# EAGLE schematic Supercell 1.3 (EAGLE 8.2.2)

## Sheet 1 of 5: Power
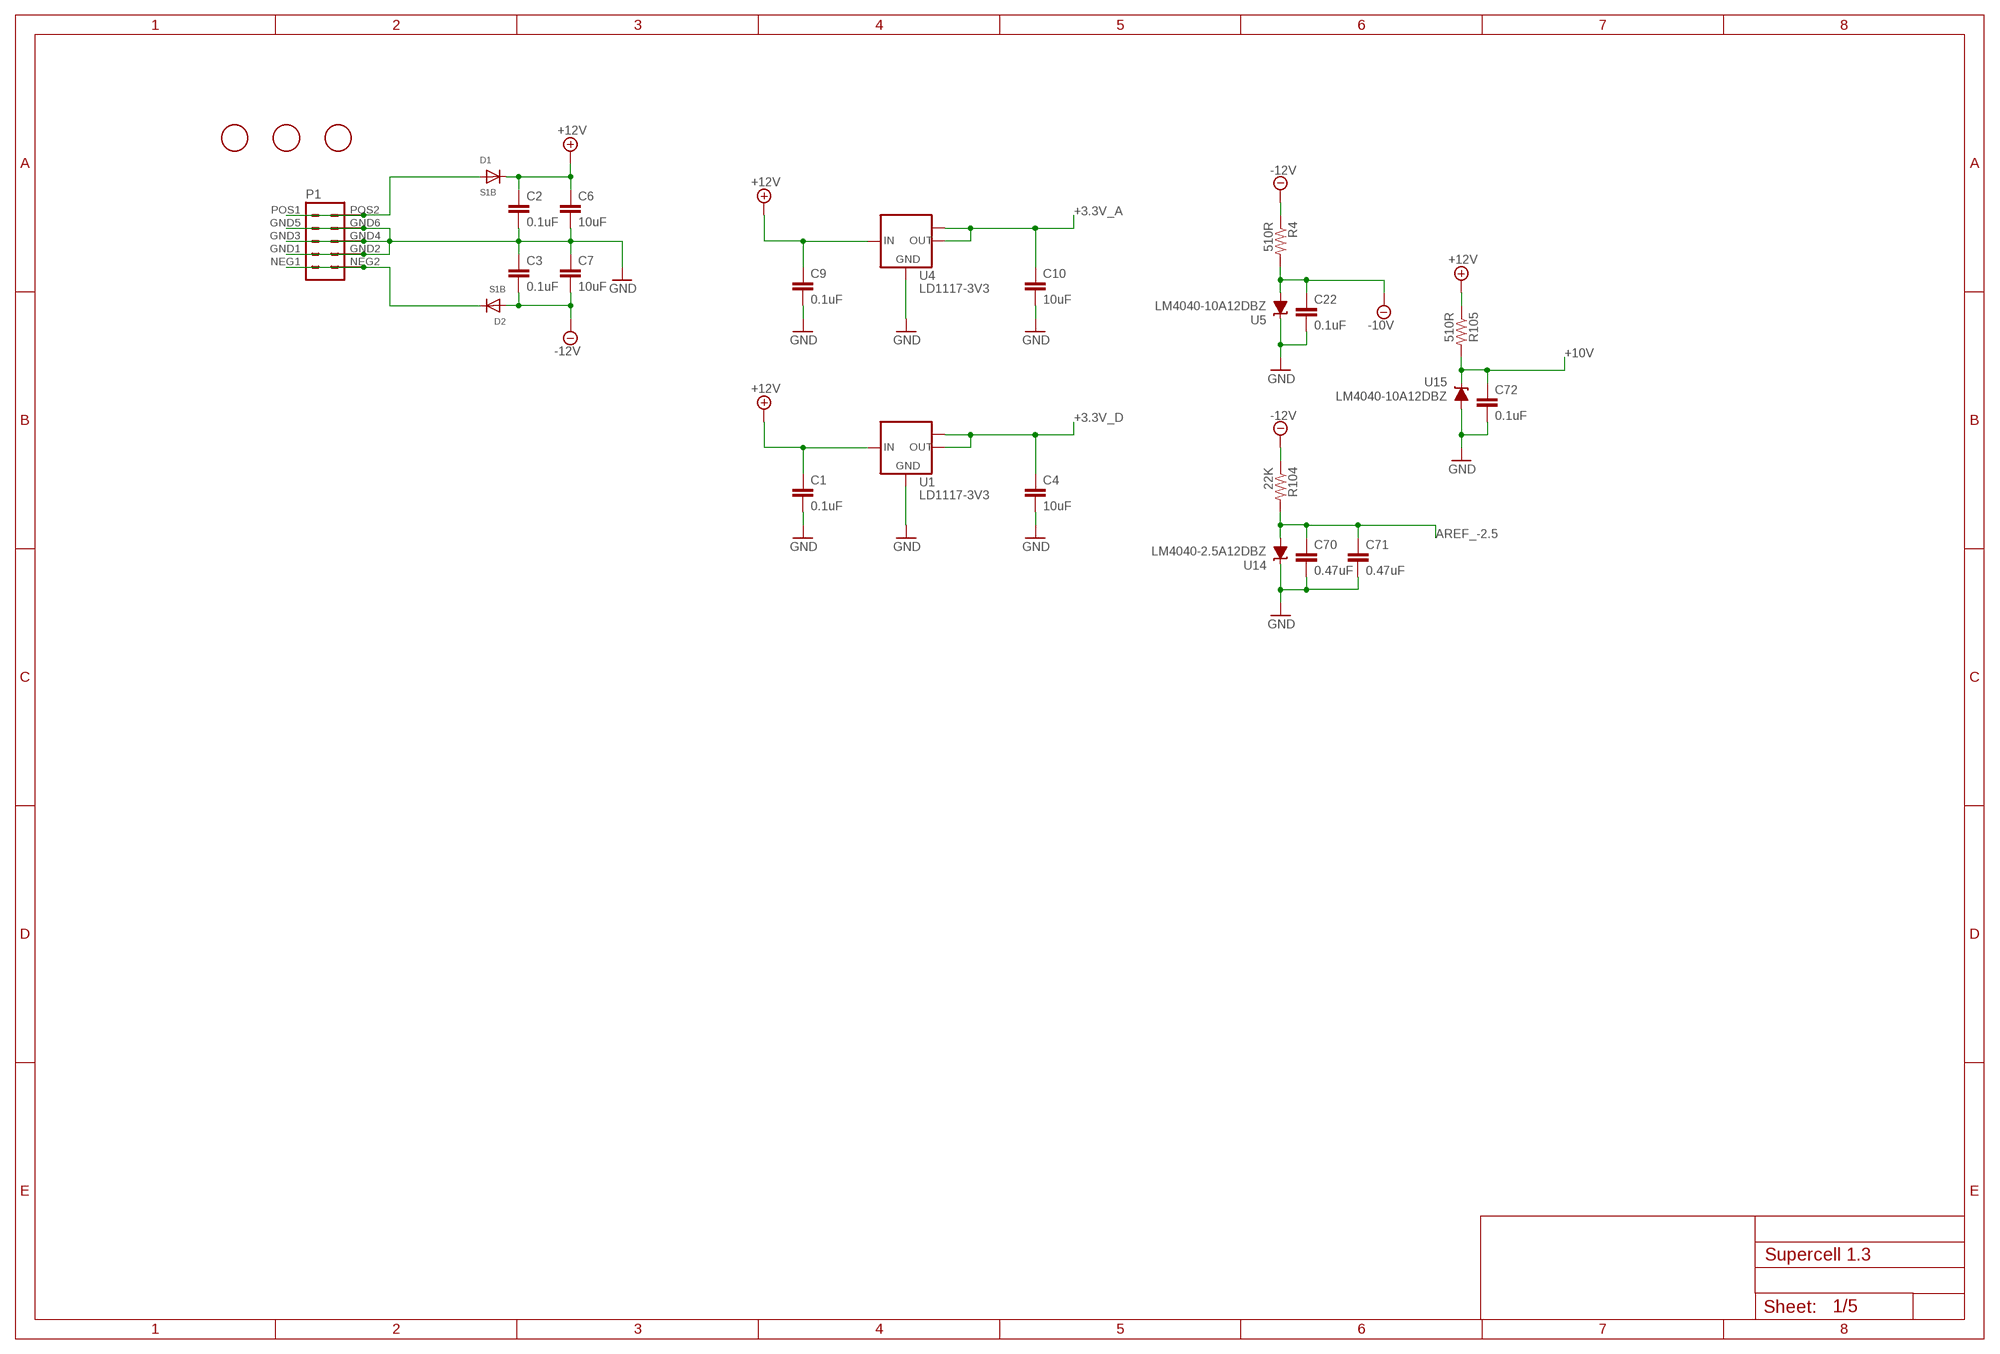
[diagram p0: schematic, sheet 1]

### Parts
C1  0.1uF  C-EUC0603  [C0603]
C2  0.1uF  C-EUC0603  [C0603]
C3  0.1uF  C-EUC0603  [C0603]
C4  10uF  C-EUC0805  [C0805]
C6  10uF  C-EUC0805  [C0805]
C7  10uF  C-EUC0805  [C0805]
C9  0.1uF  C-EUC0603  [C0603]
C10  10uF  C-EUC0805  [C0805]
C22  0.1uF  C-EUC0603  [C0603]
C70  0.47uF  C-EUC0603  [C0603]
C71  0.47uF  C-EUC0603  [C0603]
C72  0.1uF  C-EUC0603  [C0603]
D1  S1B  DIODESMA  [SMADIODE]
D2  S1B  DIODESMA  [SMADIODE]
FD1  FIDUCIAL  [FIDUCIAL_1MM]
FD2  FIDUCIAL  [FIDUCIAL_1MM]
FD3  FIDUCIAL  [FIDUCIAL_1MM]
P1  EURO_POWER_HEADERLOCK_PADS  [EURO_PWR_HEADER_LOCK]
R4  510R  R-US_R0603  [R0603]
R104  22K  R-US_R0603  [R0603]
R105  510R  R-US_R0603  [R0603]
U1  LD1117-3V3  LM1117MPX-3.3  [SOT223]
U4  LD1117-3V3  LM1117MPX-3.3  [SOT223]
U5  LM4040-10A12DBZ  [DBZ_R-PDSO-G3]
U14  LM4040-2.5A12DBZ  [DBZ_R-PDSO-G3]
U15  LM4040-10A12DBZ  [DBZ_R-PDSO-G3]

### Nets
+3.3V_A: C10.1 U4.2(OUT) U4.TAB(OUT1) ; also sheet 2,3,4
+3.3V_D: C4.1 U1.2(OUT) U1.TAB(OUT1) ; also sheet 2,3,4
+10V: C72.1 R105.2 U15.1(C) ; also sheet 5
+12V: C1.1 C2.1 C6.1 C9.1 D1.C R105.1 U1.3(IN) U4.3(IN) ; also sheet 3,5
-10V: C22.1 R4.2 U5.2(A) ; also sheet 3
-12V: C3.2 C7.2 D2.A R4.1 R104.1 ; also sheet 3,5
AREF_-2.5: C70.1 C71.1 R104.2 U14.2(A) ; also sheet 5
GND: C1.2 C2.2 C3.1 C4.2 C6.2 C7.1 C9.2 C10.2 C22.2 C70.2 C71.2 C72.2 P1.GND1 P1.GND2 P1.GND3 P1.GND4 P1.GND5 P1.GND6 U1.1(GND) U4.1(GND) U5.1(C) U14.1(C) U15.2(A) ; also sheet 2,3,4,5
N$2: D1.A P1.POS1 P1.POS2
N$6: D2.C P1.NEG1 P1.NEG2

## Sheet 2 of 5: Digital
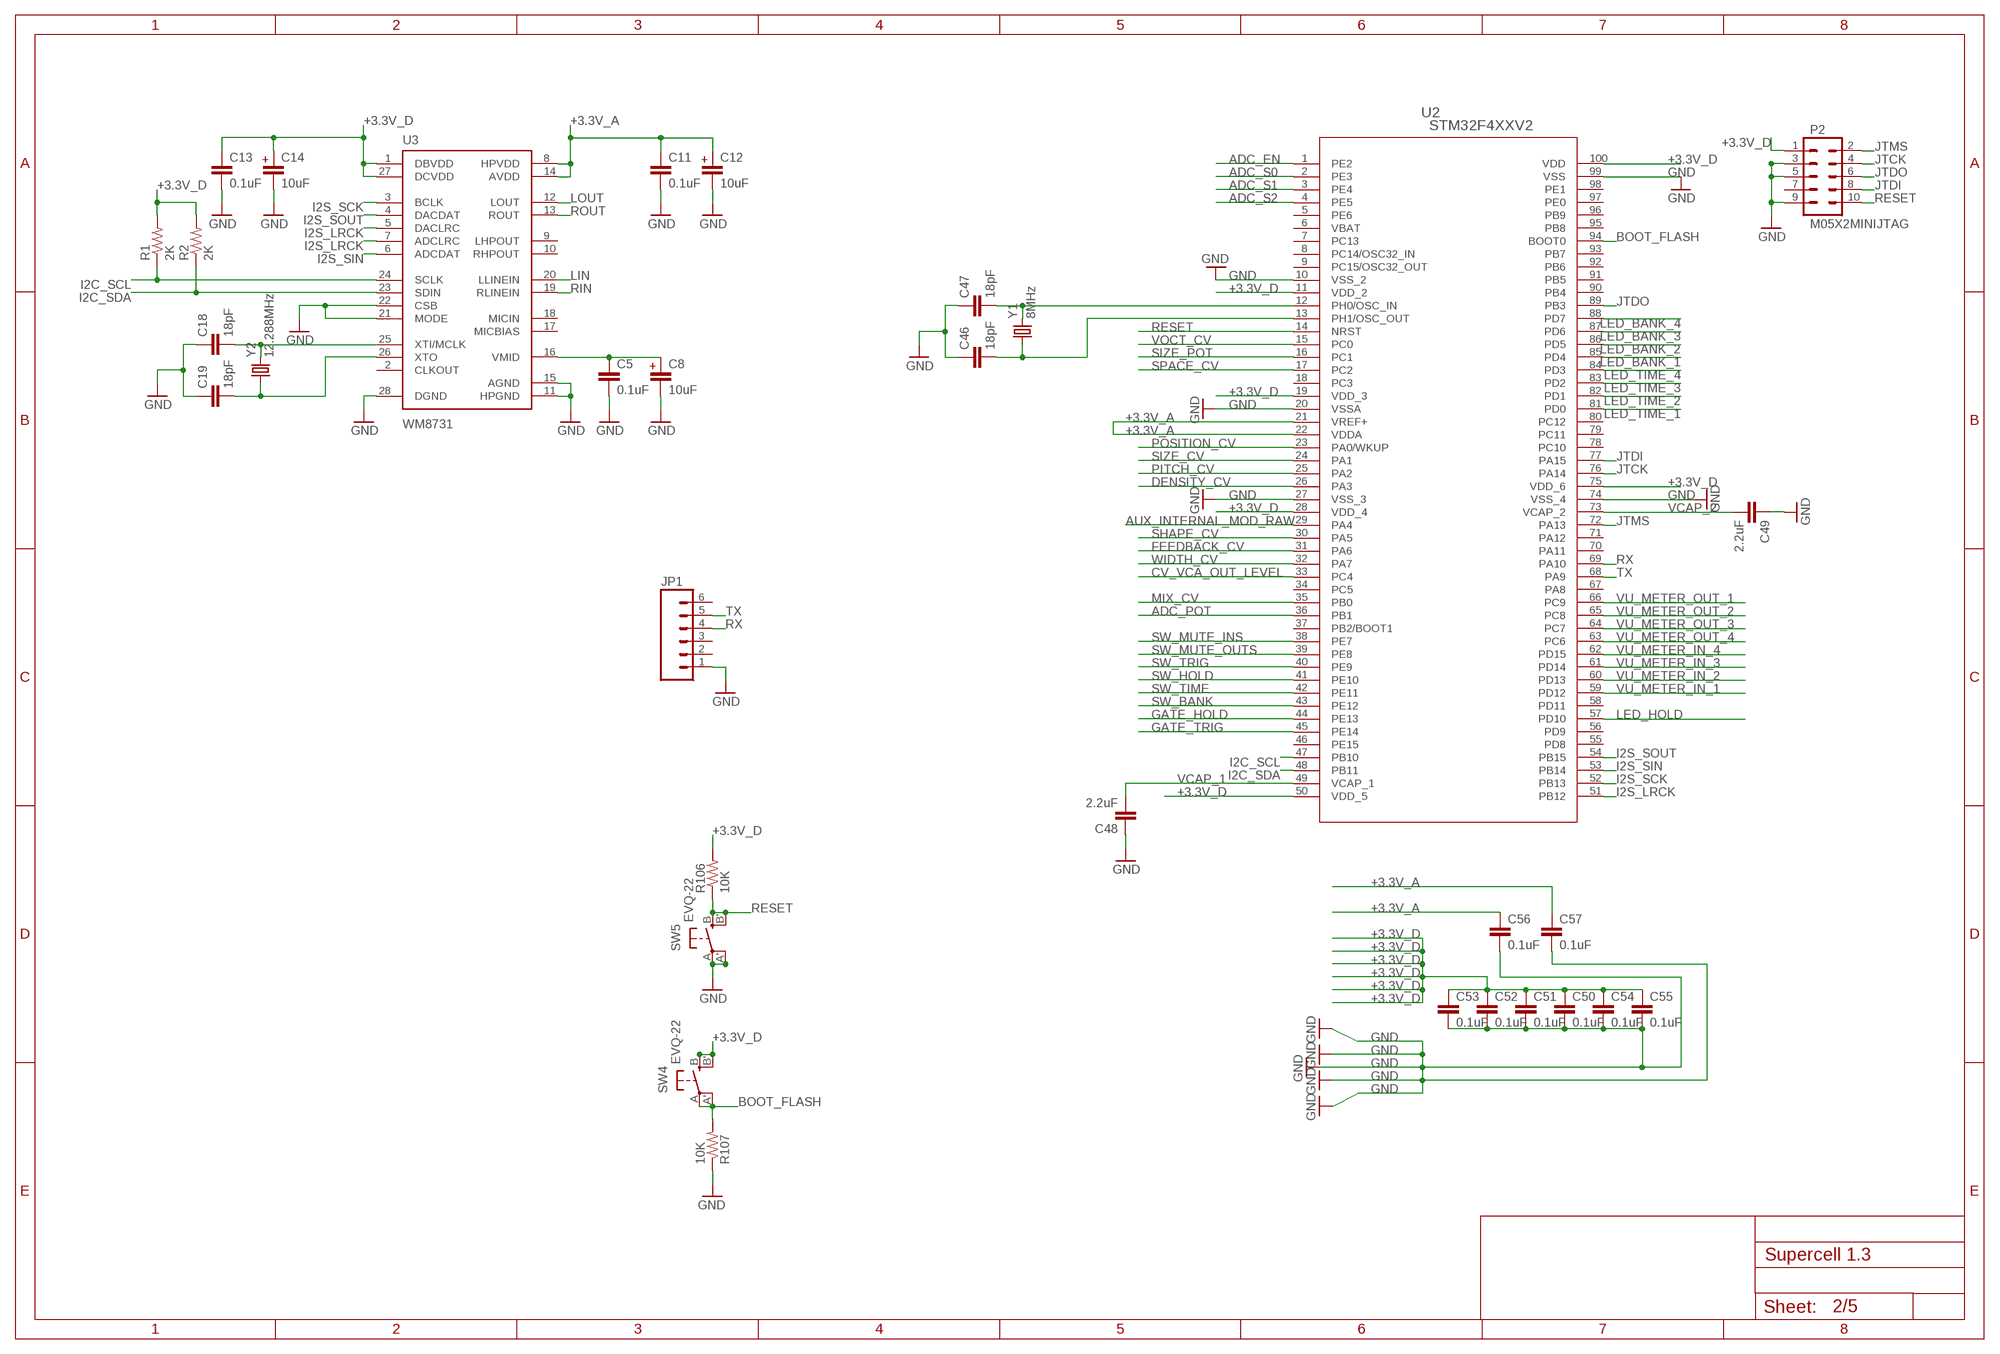
[diagram p1: schematic, sheet 2]

### Parts
C5  0.1uF  C-EUC0603  [C0603]
C8  10uF  C-EU-POL_4D  [EC-4X7]
C11  0.1uF  C-EUC0603  [C0603]
C12  10uF  C-EU-POL_4D  [EC-4X7]
C13  0.1uF  C-EUC0603  [C0603]
C14  10uF  C-EU-POL_4D  [EC-4X7]
C18  18pF  C-EUC0603  [C0603]
C19  18pF  C-EUC0603  [C0603]
C46  18pF  C-EUC0603  [C0603]
C47  18pF  C-EUC0603  [C0603]
C48  2.2uF  C-EUC0603  [C0603]
C49  2.2uF  C-EUC0603  [C0603]
C50  0.1uF  C-EUC0603  [C0603]
C51  0.1uF  C-EUC0603  [C0603]
C52  0.1uF  C-EUC0603  [C0603]
C53  0.1uF  C-EUC0603  [C0603]
C54  0.1uF  C-EUC0603  [C0603]
C55  0.1uF  C-EUC0603  [C0603]
C56  0.1uF  C-EUC0603  [C0603]
C57  0.1uF  C-EUC0603  [C0603]
JP1  M06SIP  [1X06]
P2  M05X2MINIJTAG  [2X5-1.27]
R1  2K  R-US_R0603  [R0603]
R2  2K  R-US_R0603  [R0603]
R106  10K  R-US_R0603  [R0603]
R107  10K  R-US_R0603  [R0603]
SW4  EVQ-22  EVQQ2  [EVQ-Q2]
SW5  EVQ-22  EVQQ2  [EVQ-Q2]
U2  STM32F4XXV2  [LQFP100-14X14MM]
U3  WM8731  [SSOP28]
Y1  8MHz  CRYSTALHC49UP  [HC49UP]
Y2  12.288MHz  CRYSTALHC49UP  [HC49UP]

### Nets
+3.3V_A: C11.1 C12.P$1(POS) C56.1 C57.1 U2.21(VREF+) U2.22(VDDA) U3.8(HPVDD) U3.14(AVDD) ; also sheet 1,3,4
+3.3V_D: C13.1 C14.P$1(POS) C50.1 C51.1 C52.1 C53.1 C54.1 C55.1 P2.1 R1.2 R2.2 R106.2 SW4.B'(S1) SW4.B(S) U2.11(VDD_2) U2.19(VDD_3) U2.28(VDD_4) U2.50(VDD_5) U2.75(VDD_6) U2.100(VDD) U3.1(DBVDD) U3.27(DCVDD) ; also sheet 1,3,4
ADC_EN: U2.1(PE2) ; also sheet 4
ADC_POT: U2.36(PB1) ; also sheet 4
ADC_S0: U2.2(PE3) ; also sheet 4
ADC_S1: U2.3(PE4) ; also sheet 4
ADC_S2: U2.4(PE5) ; also sheet 4
AUX_INTERNAL_MOD_RAW: U2.29(PA4) ; also sheet 3
BOOT_FLASH: R107.2 SW4.A'(P1) SW4.A(P) U2.94(BOOT0)
CV_VCA_OUT_LEVEL: U2.33(PC4) ; also sheet 5
DENSITY_CV: U2.26(PA3) ; also sheet 3
FEEDBACK_CV: U2.31(PA6) ; also sheet 3
GATE_HOLD: U2.44(PE13) ; also sheet 3
GATE_TRIG: U2.45(PE14) ; also sheet 3
GND: C5.2 C8.P$2(NEG) C11.2 C12.P$2(NEG) C13.2 C14.P$2(NEG) C18.1 C19.1 C46.1 C47.1 C48.1 C49.1 C50.2 C51.2 C52.2 C53.2 C54.2 C55.2 C56.2 C57.2 JP1.1 P2.3 P2.5 P2.9 R107.1 SW5.A'(P1) SW5.A(P) U2.10(VSS_2) U2.20(VSSA) U2.27(VSS_3) U2.74(VSS_4) U2.99(VSS) U3.11(HPGND) U3.15(AGND) U3.21(MODE) U3.22(CSB) U3.28(DGND) ; also sheet 1,3,4,5
I2C_SCL: R1.1 U2.47(PB10) U3.24(SCLK)
I2C_SDA: R2.1 U2.48(PB11) U3.23(SDIN)
I2S_LRCK: U2.51(PB12) U3.5(DACLRC) U3.7(ADCLRC)
I2S_SCK: U2.52(PB13) U3.3(BCLK)
I2S_SIN: U2.53(PB14) U3.6(ADCDAT)
I2S_SOUT: U2.54(PB15) U3.4(DACDAT)
JTCK: P2.4 U2.76(PA14)
JTDI: P2.8 U2.77(PA15)
JTDO: P2.6 U2.89(PB3)
JTMS: P2.2 U2.72(PA13)
LED_BANK_1: U2.85(PD4) ; also sheet 4
LED_BANK_2: U2.86(PD5) ; also sheet 4
LED_BANK_3: U2.87(PD6) ; also sheet 4
LED_BANK_4: U2.88(PD7) ; also sheet 4
LED_HOLD: U2.57(PD10) ; also sheet 4
LED_TIME_1: U2.81(PD0) ; also sheet 4
LED_TIME_2: U2.82(PD1) ; also sheet 4
LED_TIME_3: U2.83(PD2) ; also sheet 4
LED_TIME_4: U2.84(PD3) ; also sheet 4
LIN: U3.20(LLINEIN) ; also sheet 5
LOUT: U3.12(LOUT) ; also sheet 5
MIX_CV: U2.35(PB0) ; also sheet 3
N$1: C5.1 C8.P$1(POS) U3.16(VMID)
N$59: C19.2 U3.26(XTO) Y2.1
N$60: C18.2 U3.25(XTI/MCLK) Y2.2
N$112: C46.2 U2.13(PH1/OSC_OUT) Y1.1
N$114: C47.2 U2.12(PH0/OSC_IN) Y1.2
PITCH_CV: U2.25(PA2) ; also sheet 3
POSITION_CV: U2.23(PA0/WKUP) ; also sheet 3
RESET: P2.10 R106.1 SW5.B'(S1) SW5.B(S) U2.14(NRST)
RIN: U3.19(RLINEIN) ; also sheet 5
ROUT: U3.13(ROUT) ; also sheet 5
RX: JP1.4 U2.69(PA10)
SHAPE_CV: U2.30(PA5) ; also sheet 3
SIZE_CV: U2.24(PA1) ; also sheet 3
SIZE_POT: U2.16(PC1) ; also sheet 4
SPACE_CV: U2.17(PC2) ; also sheet 3
SW_BANK: U2.43(PE12) ; also sheet 4
SW_HOLD: U2.41(PE10) ; also sheet 4
SW_MUTE_INS: U2.38(PE7) ; also sheet 4
SW_MUTE_OUTS: U2.39(PE8) ; also sheet 4
SW_TIME: U2.42(PE11) ; also sheet 4
SW_TRIG: U2.40(PE9) ; also sheet 4
TX: JP1.5 U2.68(PA9)
VCAP_1: C48.2 U2.49(VCAP_1)
VCAP_2: C49.2 U2.73(VCAP_2)
VOCT_CV: U2.15(PC0) ; also sheet 3
VU_METER_IN_1: U2.59(PD12) ; also sheet 4
VU_METER_IN_2: U2.60(PD13) ; also sheet 4
VU_METER_IN_3: U2.61(PD14) ; also sheet 4
VU_METER_IN_4: U2.62(PD15) ; also sheet 4
VU_METER_OUT_1: U2.66(PC9) ; also sheet 4
VU_METER_OUT_2: U2.65(PC8) ; also sheet 4
VU_METER_OUT_3: U2.64(PC7) ; also sheet 4
VU_METER_OUT_4: U2.63(PC6) ; also sheet 4
WIDTH_CV: U2.32(PA7) ; also sheet 3
Unconnected: JP1.2 JP1.3 JP1.6 P2.7 U2.5(PE6) U2.7(PC13) U2.8(PC14/OSC32_IN) U2.9(PC15/OSC32_OUT) U2.18(PC3) U2.34(PC5) U2.37(PB2/BOOT1) U2.46(PE15) U2.55(PD8) U2.56(PD9) U2.58(PD11) U2.67(PA8) U2.70(PA11) U2.71(PA12) U2.78(PC10) U2.79(PC11) U2.80(PC12) U2.90(PB4) U2.91(PB5) U2.92(PB6) U2.93(PB7) U2.95(PB8) U2.96(PB9) U2.97(PE0) U2.98(PE1) U3.2(CLKOUT) U3.9(LHPOUT) U3.10(RHPOUT) U3.17(MICBIAS) U3.18(MICIN)

## Sheet 3 of 5: Control Signals
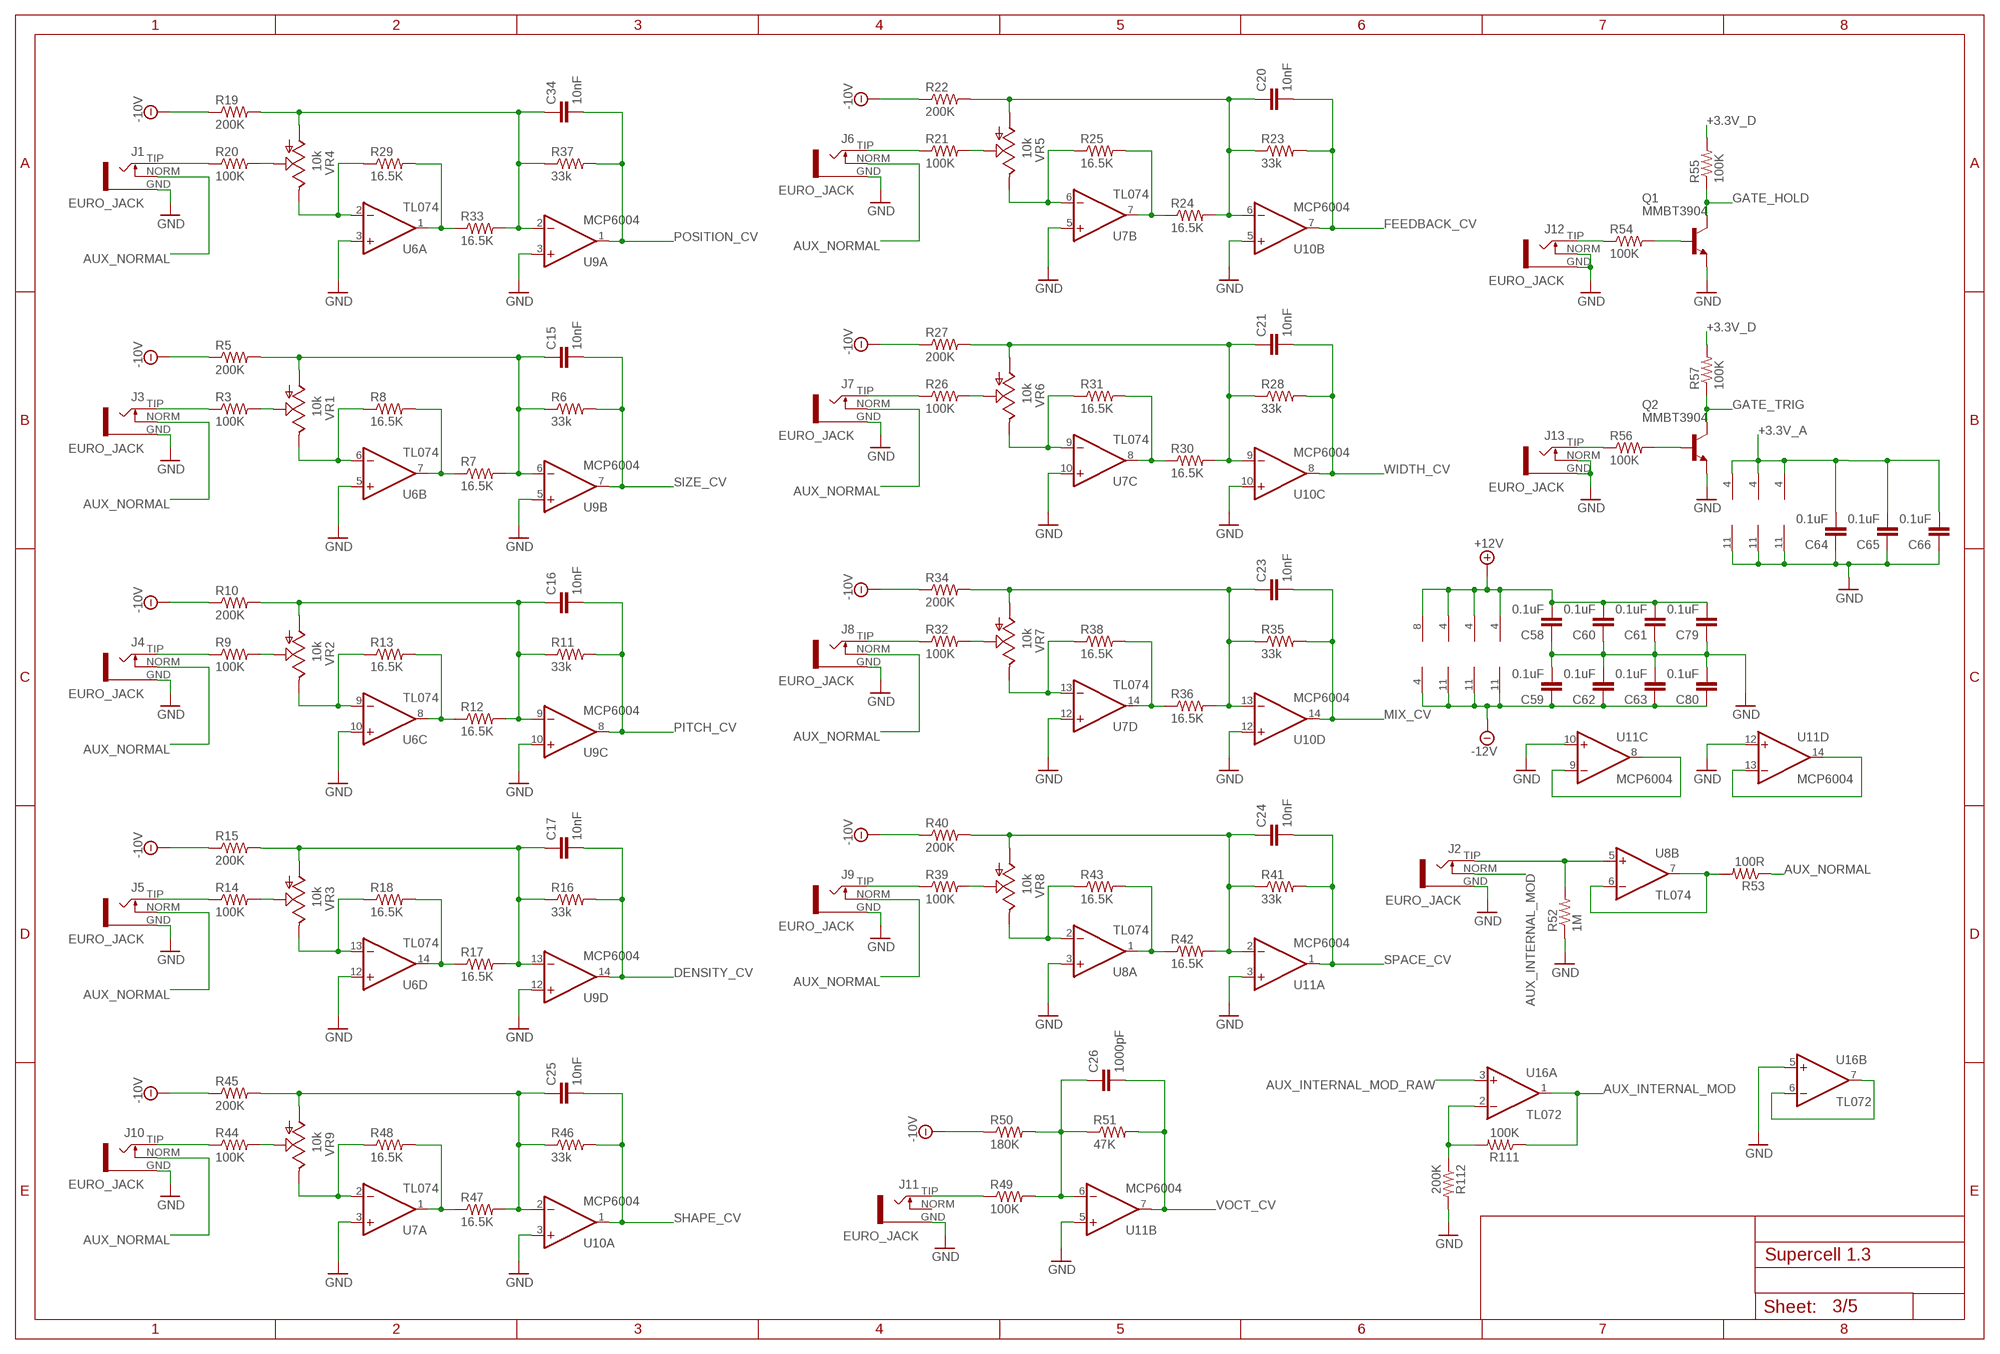
[diagram p2: schematic, sheet 3]

### Parts
C15  10nF  C-EUC0603  [C0603]
C16  10nF  C-EUC0603  [C0603]
C17  10nF  C-EUC0603  [C0603]
C20  10nF  C-EUC0603  [C0603]
C21  10nF  C-EUC0603  [C0603]
C23  10nF  C-EUC0603  [C0603]
C24  10nF  C-EUC0603  [C0603]
C25  10nF  C-EUC0603  [C0603]
C26  1000pF  C-EUC0603  [C0603]
C34  10nF  C-EUC0603  [C0603]
C58  0.1uF  C-EUC0603  [C0603]
C59  0.1uF  C-EUC0603  [C0603]
C60  0.1uF  C-EUC0603  [C0603]
C61  0.1uF  C-EUC0603  [C0603]
C62  0.1uF  C-EUC0603  [C0603]
C63  0.1uF  C-EUC0603  [C0603]
C64  0.1uF  C-EUC0603  [C0603]
C65  0.1uF  C-EUC0603  [C0603]
C66  0.1uF  C-EUC0603  [C0603]
C79  0.1uF  C-EUC0603  [C0603]
C80  0.1uF  C-EUC0603  [C0603]
J1  EURO_JACK  [S_JACK]
J2  EURO_JACK  [S_JACK]
J3  EURO_JACK  [S_JACK]
J4  EURO_JACK  [S_JACK]
J5  EURO_JACK  [S_JACK]
J6  EURO_JACK  [S_JACK]
J7  EURO_JACK  [S_JACK]
J8  EURO_JACK  [S_JACK]
J9  EURO_JACK  [S_JACK]
J10  EURO_JACK  [S_JACK]
J11  EURO_JACK  [S_JACK]
J12  EURO_JACK  [S_JACK]
J13  EURO_JACK  [S_JACK]
Q1  MMBT3904  MMBT3904LT1-NPN-SOT23-BEC  [SOT23-BEC]
Q2  MMBT3904  MMBT3904LT1-NPN-SOT23-BEC  [SOT23-BEC]
R3  100K  R-US_R0603  [R0603]
R5  200K  R-US_R0603  [R0603]
R6  33k  R-US_R0603  [R0603]
R7  16.5K  R-US_R0603  [R0603]
R8  16.5K  R-US_R0603  [R0603]
R9  100K  R-US_R0603  [R0603]
R10  200K  R-US_R0603  [R0603]
R11  33k  R-US_R0603  [R0603]
R12  16.5K  R-US_R0603  [R0603]
R13  16.5K  R-US_R0603  [R0603]
R14  100K  R-US_R0603  [R0603]
R15  200K  R-US_R0603  [R0603]
R16  33k  R-US_R0603  [R0603]
R17  16.5K  R-US_R0603  [R0603]
R18  16.5K  R-US_R0603  [R0603]
R19  200K  R-US_R0603  [R0603]
R20  100K  R-US_R0603  [R0603]
R21  100K  R-US_R0603  [R0603]
R22  200K  R-US_R0603  [R0603]
R23  33k  R-US_R0603  [R0603]
R24  16.5K  R-US_R0603  [R0603]
R25  16.5K  R-US_R0603  [R0603]
R26  100K  R-US_R0603  [R0603]
R27  200K  R-US_R0603  [R0603]
R28  33k  R-US_R0603  [R0603]
R29  16.5K  R-US_R0603  [R0603]
R30  16.5K  R-US_R0603  [R0603]
R31  16.5K  R-US_R0603  [R0603]
R32  100K  R-US_R0603  [R0603]
R33  16.5K  R-US_R0603  [R0603]
R34  200K  R-US_R0603  [R0603]
R35  33k  R-US_R0603  [R0603]
R36  16.5K  R-US_R0603  [R0603]
R37  33k  R-US_R0603  [R0603]
R38  16.5K  R-US_R0603  [R0603]
R39  100K  R-US_R0603  [R0603]
R40  200K  R-US_R0603  [R0603]
R41  33k  R-US_R0603  [R0603]
R42  16.5K  R-US_R0603  [R0603]
R43  16.5K  R-US_R0603  [R0603]
R44  100K  R-US_R0603  [R0603]
R45  200K  R-US_R0603  [R0603]
R46  33k  R-US_R0603  [R0603]
R47  16.5K  R-US_R0603  [R0603]
R48  16.5K  R-US_R0603  [R0603]
R49  100K  R-US_R0603  [R0603]
R50  180K  R-US_R0603  [R0603]
R51  47K  R-US_R0603  [R0603]
R52  1M  R-US_R0603  [R0603]
R53  100R  R-US_R0603  [R0603]
R54  100K  R-US_R0603  [R0603]
R55  100K  R-US_R0603  [R0603]
R56  100K  R-US_R0603  [R0603]
R57  100K  R-US_R0603  [R0603]
R111  100K  R-US_R0603  [R0603]
R112  200K  R-US_R0603  [R0603]
U6  TL074  QUAD_OPAMPD  [SO14]
U7  TL074  QUAD_OPAMPD  [SO14]
U8  TL074  QUAD_OPAMPD  [SO14]
U9  MCP6004  QUAD_OPAMPD  [SO14]
U10  MCP6004  QUAD_OPAMPD  [SO14]
U11  MCP6004  QUAD_OPAMPD  [SO14]
U16  TL072  DUAL_OPAMP  [SO08_BOXPIN]
VR1  10k  POT_9MM_SNAP-IN_  [9MM_SNAP-IN_POT_NO_SILK]
VR2  10k  POT_9MM_SNAP-IN_  [9MM_SNAP-IN_POT_NO_SILK]
VR3  10k  POT_9MM_SNAP-IN_  [9MM_SNAP-IN_POT_NO_SILK]
VR4  10k  POT_9MM_SNAP-IN_  [9MM_SNAP-IN_POT_NO_SILK]
VR5  10k  POT_9MM_SNAP-IN_  [9MM_SNAP-IN_POT_NO_SILK]
VR6  10k  POT_9MM_SNAP-IN_  [9MM_SNAP-IN_POT_NO_SILK]
VR7  10k  POT_9MM_SNAP-IN_  [9MM_SNAP-IN_POT_NO_SILK]
VR8  10k  POT_9MM_SNAP-IN_  [9MM_SNAP-IN_POT_NO_SILK]
VR9  10k  POT_9MM_SNAP-IN_  [9MM_SNAP-IN_POT_NO_SILK]

### Nets
+3.3V_A: C64.2 C65.2 C66.2 U9.4(P:V+) U10.4(P:V+) U11.4(P:V+) ; also sheet 1,2,4
+3.3V_D: R55.2 R57.2 ; also sheet 1,2,4
+12V: C58.2 C60.2 C61.2 C79.2 U6.4(P:V+) U7.4(P:V+) U8.4(P:V+) U16.8(P:V+) ; also sheet 1,5
-10V: R5.1 R10.1 R15.1 R19.1 R22.1 R27.1 R34.1 R40.1 R45.1 R50.1 ; also sheet 1
-12V: C59.1 C62.1 C63.1 C80.1 U6.11(P:V-) U7.11(P:V-) U8.11(P:V-) U16.4(P:V-) ; also sheet 1,5
AUX_INTERNAL_MOD: J2.NORM R111.1 U16.1(A:OUT)
AUX_INTERNAL_MOD_RAW: U16.3(A:+IN) ; also sheet 2
AUX_NORMAL: J1.NORM J3.NORM J4.NORM J5.NORM J6.NORM J7.NORM J8.NORM J9.NORM J10.NORM R53.1
DENSITY_CV: C17.2 R16.2 U9.14(D:OUT) ; also sheet 2
FEEDBACK_CV: C20.2 R23.2 U10.7(B:OUT) ; also sheet 2
GATE_HOLD: Q1.C R55.1 ; also sheet 2
GATE_TRIG: Q2.C R57.1 ; also sheet 2
GND: C58.1 C59.2 C60.1 C61.1 C62.2 C63.2 C64.1 C65.1 C66.1 C79.1 C80.2 J1.GND J2.GND J3.GND J4.GND J5.GND J6.GND J7.GND J8.GND J9.GND J10.GND J11.GND J12.GND J12.NORM J13.GND J13.NORM Q1.E Q2.E R52.1 R112.2 U6.3(A:+IN) U6.5(B:+IN) U6.10(C:+IN) U6.12(D:+IN) U7.3(A:+IN) U7.5(B:+IN) U7.10(C:+IN) U7.12(D:+IN) U8.3(A:+IN) U9.3(A:+IN) U9.5(B:+IN) U9.10(C:+IN) U9.11(P:V-) U9.12(D:+IN) U10.3(A:+IN) U10.5(B:+IN) U10.10(C:+IN) U10.11(P:V-) U10.12(D:+IN) U11.3(A:+IN) U11.5(B:+IN) U11.10(C:+IN) U11.11(P:V-) U11.12(D:+IN) U16.5(B:+IN) ; also sheet 1,2,4,5
MIX_CV: C23.2 R35.2 U10.14(D:OUT) ; also sheet 2
N$3: J2.TIP R52.2 U8.5(B:+IN)
N$4: J3.TIP R3.1
N$5: C15.1 R5.2 R6.1 R7.2 U9.6(B:-IN) VR1.1
N$7: R8.1 U6.6(B:-IN) VR1.3
N$8: R7.1 R8.2 U6.7(B:OUT)
N$9: R3.2 VR1.2
N$10: J4.TIP R9.1
N$11: C16.1 R10.2 R11.1 R12.2 U9.9(C:-IN) VR2.1
N$12: R13.1 U6.9(C:-IN) VR2.3
N$13: R12.1 R13.2 U6.8(C:OUT)
N$14: R9.2 VR2.2
N$15: J5.TIP R14.1
N$16: C17.1 R15.2 R16.1 R17.2 U9.13(D:-IN) VR3.1
N$17: R18.1 U6.13(D:-IN) VR3.3
N$18: R17.1 R18.2 U6.14(D:OUT)
N$19: R14.2 VR3.2
N$20: J6.TIP R21.1
N$21: C20.1 R22.2 R23.1 R24.2 U10.6(B:-IN) VR5.1
N$22: R25.1 U7.6(B:-IN) VR5.3
N$23: R24.1 R25.2 U7.7(B:OUT)
N$24: R21.2 VR5.2
N$25: J7.TIP R26.1
N$26: C21.1 R27.2 R28.1 R30.2 U10.9(C:-IN) VR6.1
N$27: R31.1 U7.9(C:-IN) VR6.3
N$28: R30.1 R31.2 U7.8(C:OUT)
N$29: R26.2 VR6.2
N$30: J8.TIP R32.1
N$31: C23.1 R34.2 R35.1 R36.2 U10.13(D:-IN) VR7.1
N$32: R38.1 U7.13(D:-IN) VR7.3
N$33: R36.1 R38.2 U7.14(D:OUT)
N$34: R32.2 VR7.2
N$35: J9.TIP R39.1
N$36: C24.1 R40.2 R41.1 R42.2 U11.2(A:-IN) VR8.1
N$37: R43.1 U8.2(A:-IN) VR8.3
N$38: R42.1 R43.2 U8.1(A:OUT)
N$39: R39.2 VR8.2
N$40: J10.TIP R44.1
N$41: C25.1 R45.2 R46.1 R47.2 U10.2(A:-IN) VR9.1
N$42: R48.1 U7.2(A:-IN) VR9.3
N$43: R47.1 R48.2 U7.1(A:OUT)
N$44: R44.2 VR9.2
N$45: J11.TIP R49.1
N$46: R53.2 U8.6(B:-IN) U8.7(B:OUT)
N$47: Q1.B R54.2
N$48: J12.TIP R54.1
N$49: C26.1 R49.2 R50.2 R51.1 U11.6(B:-IN)
N$52: Q2.B R56.2
N$53: J13.TIP R56.1
N$63: J1.TIP R20.1
N$82: C34.1 R19.2 R33.2 R37.1 U9.2(A:-IN) VR4.1
N$84: R29.1 U6.2(A:-IN) VR4.3
N$85: R29.2 R33.1 U6.1(A:OUT)
N$106: R20.2 VR4.2
N$111: U11.8(C:OUT) U11.9(C:-IN)
N$113: U11.13(D:-IN) U11.14(D:OUT)
N$116: R111.2 R112.1 U16.2(A:-IN)
N$123: U16.6(B:-IN) U16.7(B:OUT)
PITCH_CV: C16.2 R11.2 U9.8(C:OUT) ; also sheet 2
POSITION_CV: C34.2 R37.2 U9.1(A:OUT) ; also sheet 2
SHAPE_CV: C25.2 R46.2 U10.1(A:OUT) ; also sheet 2
SIZE_CV: C15.2 R6.2 U9.7(B:OUT) ; also sheet 2
SPACE_CV: C24.2 R41.2 U11.1(A:OUT) ; also sheet 2
VOCT_CV: C26.2 R51.2 U11.7(B:OUT) ; also sheet 2
WIDTH_CV: C21.2 R28.2 U10.8(C:OUT) ; also sheet 2
Unconnected: J11.NORM

## Sheet 4 of 5: Human Interface Controls
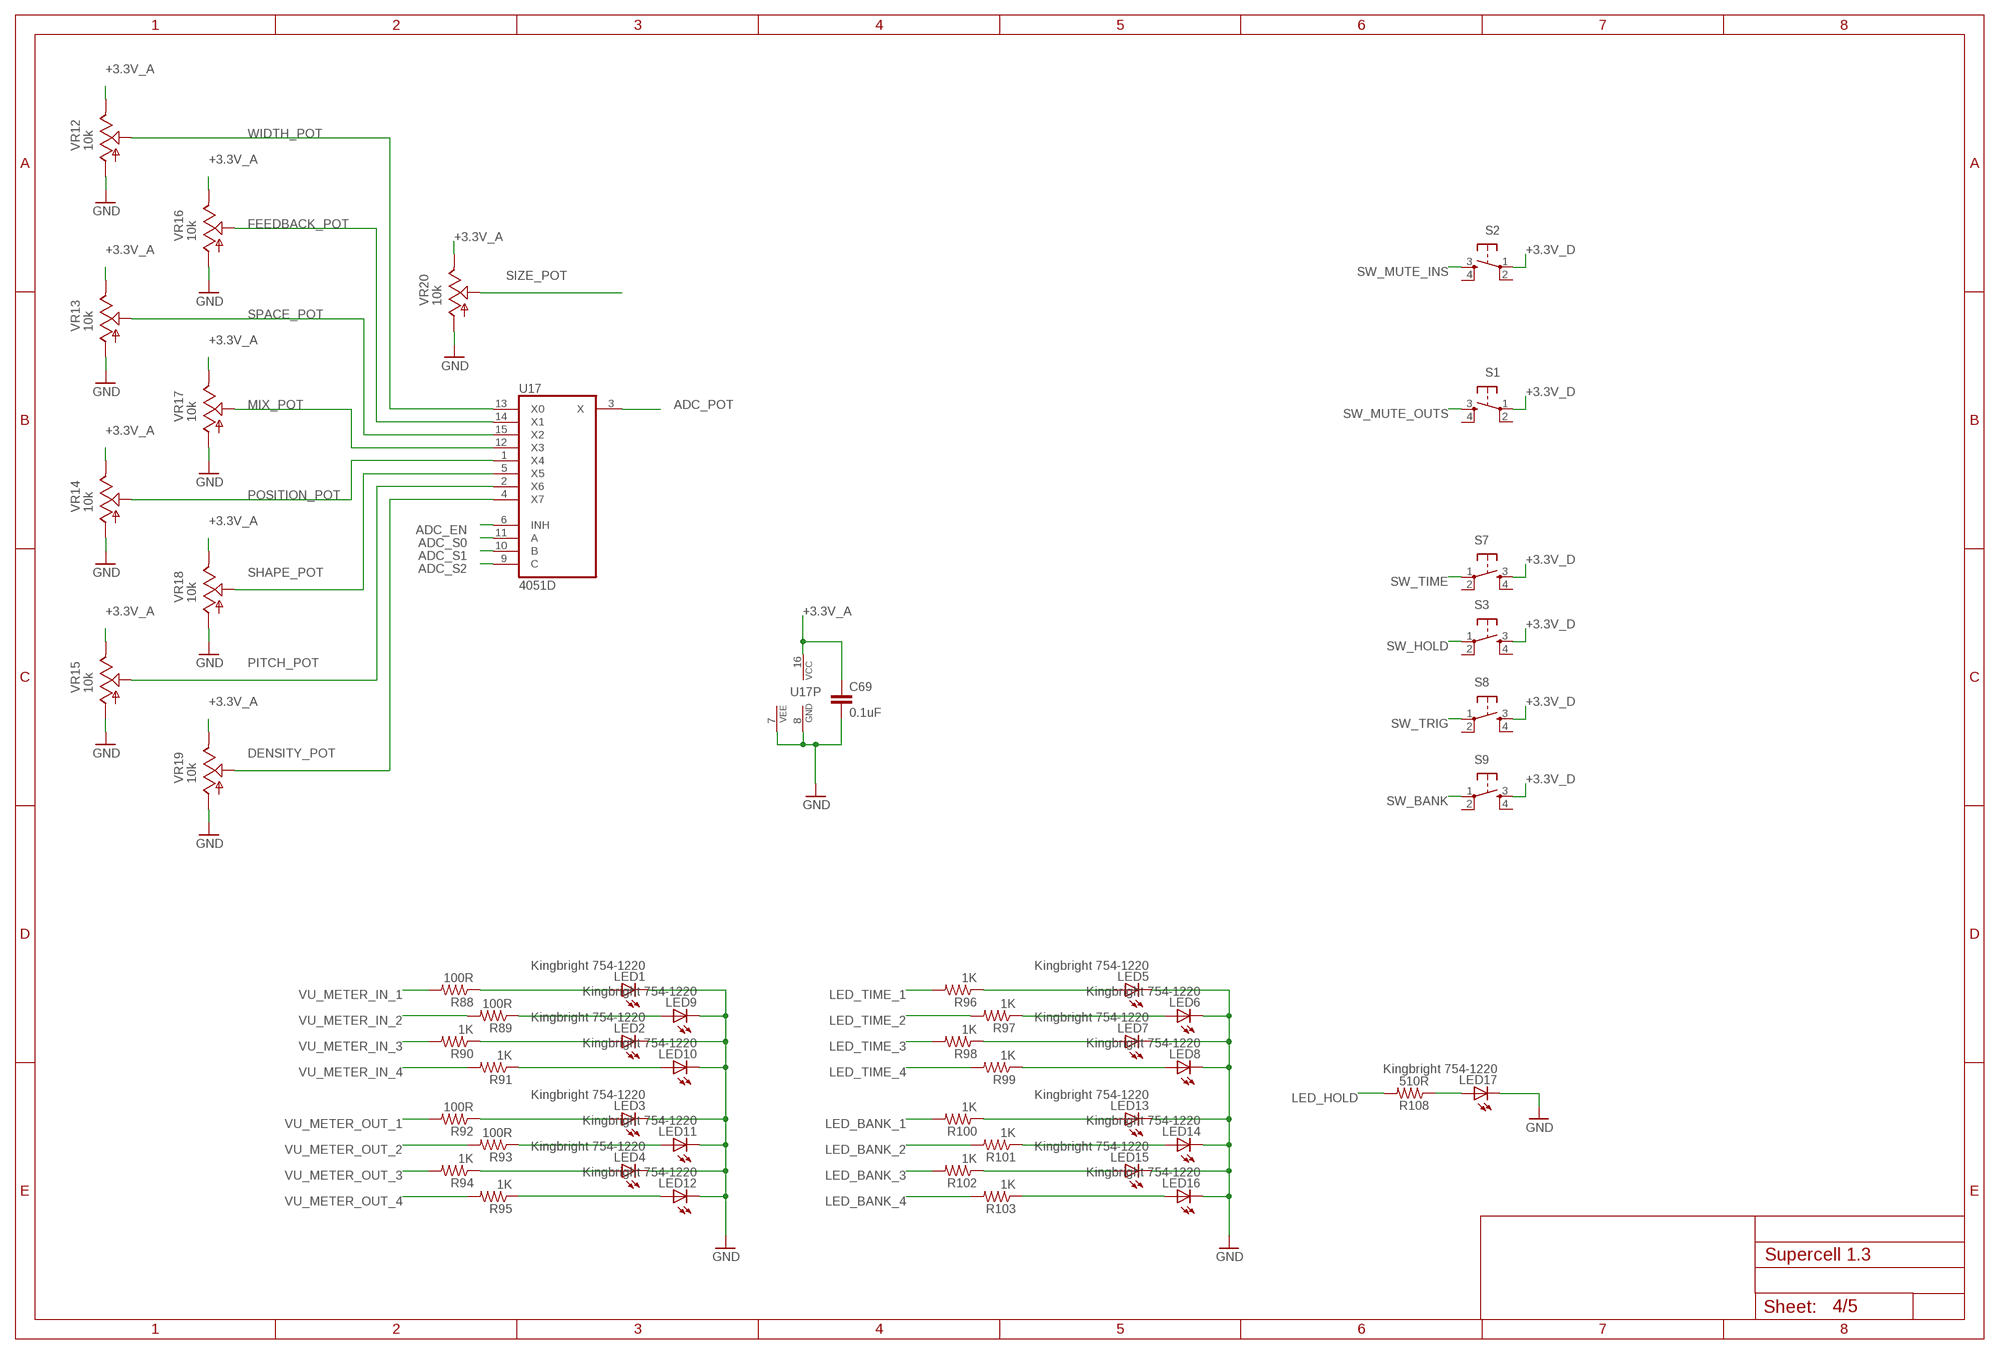
[diagram p3: schematic, sheet 4]

### Parts
C69  0.1uF  C-EUC0603  [C0603]
LED1  Kingbright 754-1220  LED_3MM_MIN  [LED_3MM_MIN]
LED2  Kingbright 754-1220  LED_3MM_MIN  [LED_3MM_MIN]
LED3  Kingbright 754-1220  LED_3MM_MIN  [LED_3MM_MIN]
LED4  Kingbright 754-1220  LED_3MM_MIN  [LED_3MM_MIN]
LED5  Kingbright 754-1220  LED_3MM_MIN  [LED_3MM_MIN]
LED6  Kingbright 754-1220  LED_3MM_MIN  [LED_3MM_MIN]
LED7  Kingbright 754-1220  LED_3MM_MIN  [LED_3MM_MIN]
LED8  Kingbright 754-1220  LED_3MM_MIN  [LED_3MM_MIN]
LED9  Kingbright 754-1220  LED_3MM_MIN  [LED_3MM_MIN]
LED10  Kingbright 754-1220  LED_3MM_MIN  [LED_3MM_MIN]
LED11  Kingbright 754-1220  LED_3MM_MIN  [LED_3MM_MIN]
LED12  Kingbright 754-1220  LED_3MM_MIN  [LED_3MM_MIN]
LED13  Kingbright 754-1220  LED_3MM_MIN  [LED_3MM_MIN]
LED14  Kingbright 754-1220  LED_3MM_MIN  [LED_3MM_MIN]
LED15  Kingbright 754-1220  LED_3MM_MIN  [LED_3MM_MIN]
LED16  Kingbright 754-1220  LED_3MM_MIN  [LED_3MM_MIN]
LED17  Kingbright 754-1220  LED_3MM_MIN  [LED_3MM_MIN]
R88  100R  R-US_R0603  [R0603]
R89  100R  R-US_R0603  [R0603]
R90  1K  R-US_R0603  [R0603]
R91  1K  R-US_R0603  [R0603]
R92  100R  R-US_R0603  [R0603]
R93  100R  R-US_R0603  [R0603]
R94  1K  R-US_R0603  [R0603]
R95  1K  R-US_R0603  [R0603]
R96  1K  R-US_R0603  [R0603]
R97  1K  R-US_R0603  [R0603]
R98  1K  R-US_R0603  [R0603]
R99  1K  R-US_R0603  [R0603]
R100  1K  R-US_R0603  [R0603]
R101  1K  R-US_R0603  [R0603]
R102  1K  R-US_R0603  [R0603]
R103  1K  R-US_R0603  [R0603]
R108  510R  R-US_R0603  [R0603]
S1  TAC_SWITCHPTH  [TACTILE-PTH]
S2  TAC_SWITCHPTH  [TACTILE-PTH]
S3  TAC_SWITCH  [C&K_D6R]
S7  TAC_SWITCH  [C&K_D6R]
S8  TAC_SWITCH  [C&K_D6R]
S9  TAC_SWITCH  [C&K_D6R]
U17  4051D  [SO16]
VR12  10k  POT_9MM_SNAP-IN_  [9MM_SNAP-IN_POT_NO_SILK]
VR13  10k  POT_9MM_SNAP-IN_  [9MM_SNAP-IN_POT_NO_SILK]
VR14  10k  POT_9MM_SNAP-IN_  [9MM_SNAP-IN_POT_NO_SILK]
VR15  10k  POT_9MM_SNAP-IN_  [9MM_SNAP-IN_POT_NO_SILK]
VR16  10k  POT_9MM_SNAP-IN_  [9MM_SNAP-IN_POT_NO_SILK]
VR17  10k  POT_9MM_SNAP-IN_  [9MM_SNAP-IN_POT_NO_SILK]
VR18  10k  POT_9MM_SNAP-IN_  [9MM_SNAP-IN_POT_NO_SILK]
VR19  10k  POT_9MM_SNAP-IN_  [9MM_SNAP-IN_POT_NO_SILK]
VR20  10k  POT_9MM_SNAP-IN_  [9MM_SNAP-IN_POT_NO_SILK]

### Nets
+3.3V_A: C69.1 U17.16(VCC) VR12.3 VR13.3 VR14.3 VR15.3 VR16.3 VR17.3 VR18.3 VR19.3 VR20.3 ; also sheet 1,2,3
+3.3V_D: S1.1 S2.1 S3.3 S7.3 S8.3 S9.3 ; also sheet 1,2,3
ADC_EN: U17.6(INH) ; also sheet 2
ADC_POT: U17.3(X) ; also sheet 2
ADC_S0: U17.11(A) ; also sheet 2
ADC_S1: U17.10(B) ; also sheet 2
ADC_S2: U17.9(C) ; also sheet 2
DENSITY_POT: U17.4(X7) VR19.2
FEEDBACK_POT: U17.14(X1) VR16.2
GND: C69.2 LED1.K(C) LED2.K(C) LED3.K(C) LED4.K(C) LED5.K(C) LED6.K(C) LED7.K(C) LED8.K(C) LED9.K(C) LED10.K(C) LED11.K(C) LED12.K(C) LED13.K(C) LED14.K(C) LED15.K(C) LED16.K(C) LED17.K(C) U17.7(VEE) U17.8(GND) VR12.1 VR13.1 VR14.1 VR15.1 VR16.1 VR17.1 VR18.1 VR19.1 VR20.1 ; also sheet 1,2,3,5
LED_BANK_1: R100.2 ; also sheet 2
LED_BANK_2: R101.2 ; also sheet 2
LED_BANK_3: R102.2 ; also sheet 2
LED_BANK_4: R103.2 ; also sheet 2
LED_HOLD: R108.2 ; also sheet 2
LED_TIME_1: R96.2 ; also sheet 2
LED_TIME_2: R97.2 ; also sheet 2
LED_TIME_3: R98.2 ; also sheet 2
LED_TIME_4: R99.2 ; also sheet 2
MIX_POT: U17.12(X3) VR17.2
N$64: LED9.A R89.1
N$81: LED17.A R108.1
N$88: LED1.A R88.1
N$94: LED2.A R90.1
N$95: LED10.A R91.1
N$97: LED3.A R92.1
N$98: LED11.A R93.1
N$99: LED4.A R94.1
N$101: LED12.A R95.1
N$102: LED6.A R97.1
N$103: LED5.A R96.1
N$104: LED7.A R98.1
N$105: LED8.A R99.1
N$107: LED13.A R100.1
N$108: LED14.A R101.1
N$109: LED15.A R102.1
N$110: LED16.A R103.1
PITCH_POT: U17.2(X6) VR15.2
POSITION_POT: U17.1(X4) VR14.2
SHAPE_POT: U17.5(X5) VR18.2
SIZE_POT: VR20.2 ; also sheet 2
SPACE_POT: U17.15(X2) VR13.2
SW_BANK: S9.1 ; also sheet 2
SW_HOLD: S3.1 ; also sheet 2
SW_MUTE_INS: S2.3 ; also sheet 2
SW_MUTE_OUTS: S1.3 ; also sheet 2
SW_TIME: S7.1 ; also sheet 2
SW_TRIG: S8.1 ; also sheet 2
VU_METER_IN_1: R88.2 ; also sheet 2
VU_METER_IN_2: R89.2 ; also sheet 2
VU_METER_IN_3: R90.2 ; also sheet 2
VU_METER_IN_4: R91.2 ; also sheet 2
VU_METER_OUT_1: R92.2 ; also sheet 2
VU_METER_OUT_2: R93.2 ; also sheet 2
VU_METER_OUT_3: R94.2 ; also sheet 2
VU_METER_OUT_4: R95.2 ; also sheet 2
WIDTH_POT: U17.13(X0) VR12.2
Unconnected: S1.2 S1.4 S2.2 S2.4 S3.2 S3.4 S7.2 S7.4 S8.2 S8.4 S9.2 S9.4

## Sheet 5 of 5: Additional
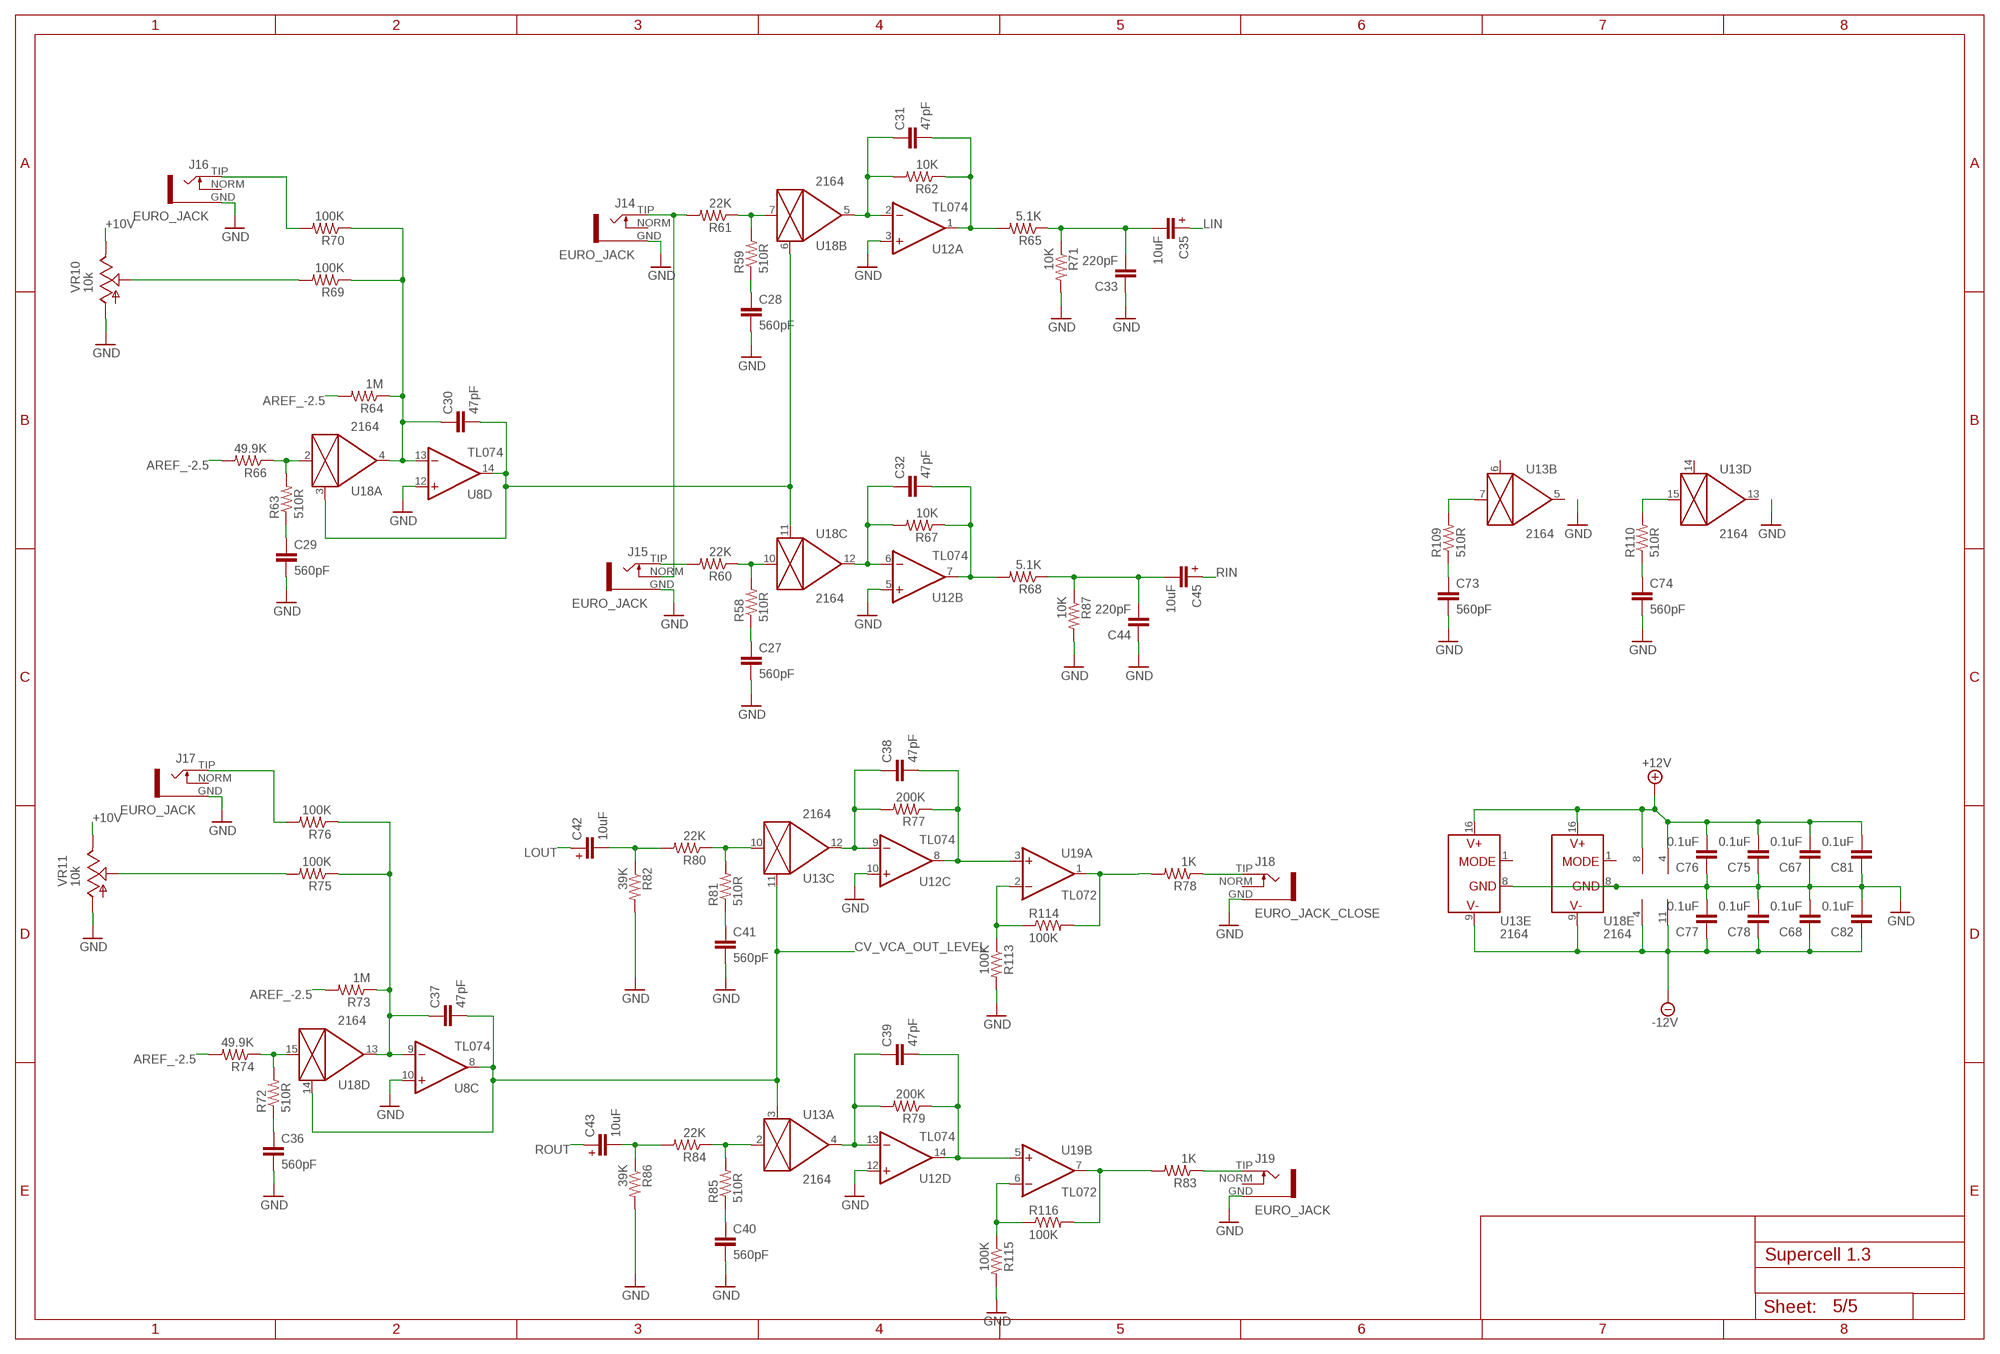
[diagram p4: schematic, sheet 5]

### Parts
C27  560pF  C-EUC0603  [C0603]
C28  560pF  C-EUC0603  [C0603]
C29  560pF  C-EUC0603  [C0603]
C30  47pF  C-EUC0603  [C0603]
C31  47pF  C-EUC0603  [C0603]
C32  47pF  C-EUC0603  [C0603]
C33  220pF  C-EUC0603  [C0603]
C35  10uF  C-EU-POL_4D  [EC-4X7]
C36  560pF  C-EUC0603  [C0603]
C37  47pF  C-EUC0603  [C0603]
C38  47pF  C-EUC0603  [C0603]
C39  47pF  C-EUC0603  [C0603]
C40  560pF  C-EUC0603  [C0603]
C41  560pF  C-EUC0603  [C0603]
C42  10uF  C-EU-POL_4D  [EC-4X7]
C43  10uF  C-EU-POL_4D  [EC-4X7]
C44  220pF  C-EUC0603  [C0603]
C45  10uF  C-EU-POL_4D  [EC-4X7]
C67  0.1uF  C-EUC0603  [C0603]
C68  0.1uF  C-EUC0603  [C0603]
C73  560pF  C-EUC0603  [C0603]
C74  560pF  C-EUC0603  [C0603]
C75  0.1uF  C-EUC0603  [C0603]
C76  0.1uF  C-EUC0603  [C0603]
C77  0.1uF  C-EUC0603  [C0603]
C78  0.1uF  C-EUC0603  [C0603]
C81  0.1uF  C-EUC0603  [C0603]
C82  0.1uF  C-EUC0603  [C0603]
J14  EURO_JACK  [S_JACK]
J15  EURO_JACK  [S_JACK]
J16  EURO_JACK  [S_JACK]
J17  EURO_JACK  [S_JACK]
J18  EURO_JACK_CLOSE  [S_JACK_CLOSE]
J19  EURO_JACK  [S_JACK]
R58  510R  R-US_R0603  [R0603]
R59  510R  R-US_R0603  [R0603]
R60  22K  R-US_R0603  [R0603]
R61  22K  R-US_R0603  [R0603]
R62  10K  R-US_R0603  [R0603]
R63  510R  R-US_R0603  [R0603]
R64  1M  R-US_R0603  [R0603]
R65  5.1K  R-US_R0603  [R0603]
R66  49.9K  R-US_R0603  [R0603]
R67  10K  R-US_R0603  [R0603]
R68  5.1K  R-US_R0603  [R0603]
R69  100K  R-US_R0603  [R0603]
R70  100K  R-US_R0603  [R0603]
R71  10K  R-US_R0603  [R0603]
R72  510R  R-US_R0603  [R0603]
R73  1M  R-US_R0603  [R0603]
R74  49.9K  R-US_R0603  [R0603]
R75  100K  R-US_R0603  [R0603]
R76  100K  R-US_R0603  [R0603]
R77  200K  R-US_R0603  [R0603]
R78  1K  R-US_R0603  [R0603]
R79  200K  R-US_R0603  [R0603]
R80  22K  R-US_R0603  [R0603]
R81  510R  R-US_R0603  [R0603]
R82  39K  R-US_R0603  [R0603]
R83  1K  R-US_R0603  [R0603]
R84  22K  R-US_R0603  [R0603]
R85  510R  R-US_R0603  [R0603]
R86  39K  R-US_R0603  [R0603]
R87  10K  R-US_R0603  [R0603]
R109  510R  R-US_R0603  [R0603]
R110  510R  R-US_R0603  [R0603]
R113  100K  R-US_R0603  [R0603]
R114  100K  R-US_R0603  [R0603]
R115  100K  R-US_R0603  [R0603]
R116  100K  R-US_R0603  [R0603]
U12  TL074  QUAD_OPAMPD  [SO14]
U13  2164  SSM2164S  [SO16]
U18  2164  SSM2164S  [SO16]
U19  TL072  DUAL_OPAMP  [SO08_BOXPIN]
VR10  10k  POT_9MM_SNAP-IN_  [9MM_SNAP-IN_POT_NO_SILK]
VR11  10k  POT_9MM_SNAP-IN_  [9MM_SNAP-IN_POT_NO_SILK]

### Nets
+10V: VR10.3 VR11.3 ; also sheet 1
+12V: C67.2 C75.2 C76.2 C81.2 U12.4(P:V+) U13.16(E:V+) U18.16(E:V+) U19.8(P:V+) ; also sheet 1,3
-12V: C68.1 C77.1 C78.1 C82.1 U12.11(P:V-) U13.9(E:V-) U18.9(E:V-) U19.4(P:V-) ; also sheet 1,3
AREF_-2.5: R64.2 R66.2 R73.2 R74.2 ; also sheet 1
CV_VCA_OUT_LEVEL: C37.2 U8.8(C:OUT) U13.3(A:CTRL) U13.11(C:CTRL) U18.14(D:CTRL) ; also sheet 2
GND: C27.2 C28.2 C29.2 C33.1 C36.2 C40.2 C41.2 C44.1 C67.1 C68.2 C73.2 C74.2 C75.1 C76.1 C77.2 C78.2 C81.1 C82.2 J14.GND J15.GND J16.GND J17.GND J18.GND J19.GND R71.2 R82.2 R86.2 R87.2 R113.2 R115.2 U8.10(C:+IN) U8.12(D:+IN) U12.3(A:+IN) U12.5(B:+IN) U12.10(C:+IN) U12.12(D:+IN) U13.8(E:GND) U18.8(E:GND) VR10.1 VR11.1 ; also sheet 1,2,3,4
LIN: C35.P$1(POS) ; also sheet 2
LOUT: C42.P$1(POS) ; also sheet 2
N$50: C28.1 R59.1
N$51: C27.1 R58.1
N$54: C29.1 R63.1
N$55: C30.2 U8.14(D:OUT) U18.3(A:CTRL) U18.6(B:CTRL) U18.11(C:CTRL)
N$56: R58.2 R60.1 U18.10(C:IN)
N$57: R63.2 R66.1 U18.2(A:IN)
N$58: C32.1 R67.2 U12.6(B:-IN) U18.12(C:OUT)
N$61: C32.2 R67.1 R68.2 U12.7(B:OUT)
N$62: J14.TIP J15.NORM R61.2
N$65: J15.TIP R60.2
N$66: J16.TIP R70.2
N$67: C36.1 R72.1
N$68: R69.2 VR10.2
N$70: R72.2 R74.1 U18.15(D:IN)
N$71: J17.TIP R76.2
N$72: R75.2 VR11.2
N$73: C38.1 R77.2 U12.9(C:-IN) U13.12(C:OUT)
N$74: C38.2 R77.1 U12.8(C:OUT) U19.3(A:+IN)
N$75: R59.2 R61.1 U18.7(B:IN)
N$76: R109.2 U13.7(B:IN)
N$77: J18.TIP R78.1
N$78: R80.1 R81.2 U13.10(C:IN)
N$79: C41.1 R81.1
N$80: C42.P$2(NEG) R80.2 R82.1
N$83: C44.2 C45.P$2(NEG) R68.1 R87.1
N$86: C39.1 R79.2 U12.13(D:-IN) U13.4(A:OUT)
N$87: C39.2 R79.1 U12.14(D:OUT) U19.5(B:+IN)
N$89: R84.1 R85.2 U13.2(A:IN)
N$90: C40.1 R85.1
N$91: C43.P$2(NEG) R84.2 R86.1
N$92: R110.2 U13.15(D:IN)
N$93: J19.TIP R83.1
N$96: C31.1 R62.2 U12.2(A:-IN) U18.5(B:OUT)
N$100: C31.2 R62.1 R65.2 U12.1(A:OUT)
N$115: R113.1 R114.1 U19.2(A:-IN)
N$117: C73.1 R109.1
N$118: C74.1 R110.1
N$119: R78.2 R114.2 U19.1(A:OUT)
N$120: R115.1 R116.1 U19.6(B:-IN)
N$121: R83.2 R116.2 U19.7(B:OUT)
N$125: C33.2 C35.P$2(NEG) R65.1 R71.1
RIN: C45.P$1(POS) ; also sheet 2
ROUT: C43.P$1(POS) ; also sheet 2
VCA_CTRL_INPUTS: C30.1 R64.1 R69.1 R70.1 U8.13(D:-IN) U18.4(A:OUT)
VCA_CTRL_INPUTS1: C37.1 R73.1 R75.1 R76.1 U8.9(C:-IN) U18.13(D:OUT)
Unconnected: J14.NORM J16.NORM J17.NORM J18.NORM J19.NORM U13.1(E:MODE) U13.5(B:OUT) U13.6(B:CTRL) U13.13(D:OUT) U13.14(D:CTRL) U18.1(E:MODE)

## Power pins joined to a net without a drawn wire
VBAT: U2.6(VBAT)

## Library data of the parts
C1-C3 C9 C27-C33 C36-C41 C44 C67 C68 C73-C78 C81 C82 = rcl:C-EU: CAPACITOR, European symbol
C4 C6 C7 C10 C22 C70-C72 = AndrewIkenberry:C-EU: CAPACITOR, European symbol
C5 C11 C13 C15-C21 C23-C26 C34 C46-C66 C69 C79 C80 = ElectroSmith:C-EU: CAPACITOR, European symbol
C8 C12 C14 C35 C42 C43 C45 = ElectroSmith:C-EU-POL
D1 D2 = adafruit:DIODE: Diode SMADIODE - SMA Surface Mount Package 20V 1A Schottky Diode Digikey: 641-1014-6-ND DO-1N4148 - Through Hole Small Current Diode SOD-123 20V 1 A (.5mV Vf) Schottky Diode - Digikey: MBRX120TPMSCT-ND SOD-323 10V 570mA (.38mV Vf, 3ns) Schottky Diode - Digikey: ZLLS410CT-ND SOD-523 30V 30mA Schottky Diode (RB751S-40TE61) - Digikey: RB751S-40TE61CT-ND SOT23-R/W - SOT23 Package (R = Solder Paste/Reflow Ovens, W = Hand-Soldering) BAT54Film 40V 300mA - Digikey: 497-7162-1-ND
FD1-FD3 = adafruit:FIDUCIAL: For use by pick and place machines to calibrate the vision/machine, 1mm By microbuilder.eu
J1-J17 = ElectroSmith:EURO_JACK
J18 = newjack:EURO_JACK
J19 = Electrosmith-Interface:EURO_JACK
JP1 = SparkFun:M06: Header 6 Standard 6-pin 0.1" header. Use with straight break away headers (SKU : PRT-00116), right angle break away headers (PRT-00553), swiss pins (PRT-00743), machine pins (PRT-00117), and female headers (PRT-00115). Molex polarized connector foot print use with SKU : PRT-08094 with associated crimp pins and housings. NOTES ON THE VARIANTS LOCK and LOCK_LONGPADS... This footprint was designed to help hold the alignment of a through-hole component (i.e. 6-pin header) while soldering it into place. You may notice that each hole has been shifted either up or down by 0.005 of an inch from it's more standard position (which is a perfectly straight line). This slight alteration caused the pins (the squares in the middle) to touch the edges of the holes. Because they are alternating, it causes a "brace" to hold the component in place. 0.005 has proven to be the perfect amount of "off-center" position when using our standard breakaway headers. Although looks a little odd when you look at the bare footprint, once you have a header in there, the alteration is very hard to notice. Also, if you push a header all the way into place, it is covered up entirely on the bottom side. This idea of altering the position of holes to aid alignment will be further integrated into the Sparkfun Library for other footprints. It can help hold any component with 3 or more connection pins.
LED1-LED17 = AndrewIkenberry:LED_3MM_MIN
P1 = AndrewIkenberry:EURO_POWER_HEADER: Power Header 10 pin power header for Eurorack Power Supplies Variants with fatter pads for easier soldering, and the LOCK variant which has 5mil offset pins to hold the component in place before soldering
P2 = og-header:M05X2: Header 5x2 Standard 10-pin dual row 0.1" header. Commonly used with AVR-ISP. Use with Spark Fun Electronics SKU: PRT-00778
Q1 Q2 = ElectroSmith:*-NPN-: NPN Transistror BF959 corrected 2008.03.06
R1 R2 = resistor:R-US_: RESISTOR, American symbol
R3 R5-R57 R88-R103 R108 R111 R112 = AndrewIkenberry:R-US_: RESISTOR, American symbol
R4 R58-R87 R104-R107 R109 R110 R113-R116 = rcl:R-US_: RESISTOR, American symbol
S1-S3 S7-S9 = SparkFun:TAC_SWITCH: Momentary Switch Button commonly used for reset or general input. Spark Fun Electronics SKU : COM-00097
SW4 SW5 = adafruit:EVQQ2: SMT 6mm switch, EVQQ2 series http://www.ladyada.net/library/eagle
U1 U4 = AndrewIkenberry:LM1117MPX-*
U2 = ElectroSmith:STM32F4XXV2; MANUFACTURER_PART_NUMBER: stm32f4xxv2; VENDOR: STMicroelectronics
U3 = ElectroSmith:WM8731
U5 U15 = ElectroSmith:LM4040-10: PRECISION MICROPOWER SHUNT VOLTAGE REFERENCE Source: http://focus.ti.com/lit/ds/slcs146e/slcs146e.pdf; MPN: LM4041A12IDBZR; OC_FARNELL: 1407949; OC_NEWARK: 58K5875
U6-U12 = ElectroSmith:QUAD_OPAMP: OP AMP
U13 U18 = ElectroSmith:SSM2164
U14 = ElectroSmith:LM4040-2.5: PRECISION MICROPOWER SHUNT VOLTAGE REFERENCE Source: http://focus.ti.com/lit/ds/slcs146e/slcs146e.pdf; MPN: LM4041A12IDBZR; OC_FARNELL: 1407949; OC_NEWARK: 58K5875
U16 U19 = Electrosmith-Misc:DUAL_OPAMP: OP AMP
U17 = og-ics:4051: 8-channel ANALOG MULTIPLEXER
VR1-VR20 = Electrosmith-Interface:POT_9MM_SNAP-IN_: 9mm vertical snap-in pot, Alpha / Panasonic style
Y1 Y2 = ElectroSmith:CRYSTAL: CRYSTAL; OC_FARNELL: unknown; OC_NEWARK: unknown

## Net classes
1 width: width 0.152 mm, clearance 0.152 mm